# Altium schematic sheet Lights.SchDoc
size A
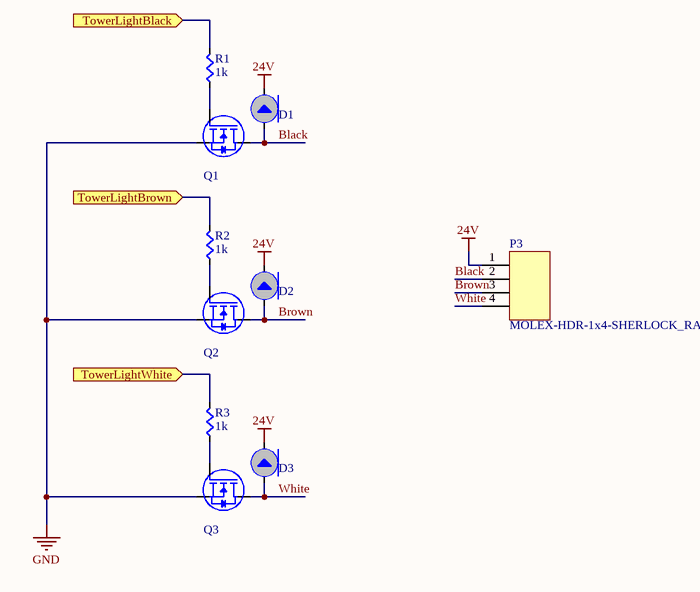
[diagram p0: Lights.SchDoc]

## Parts
D1  S1B-13-F  [SMASeries]  (value not drawn)
D2  S1B-13-F  [SMASeries]  (value not drawn)
D3  S1B-13-F  [SMASeries]  (value not drawn)
P3  MOLEX-HDR-1x4-SHERLOCK_RA  [MOLEX-HDR-1X4-SHERLOCK-RA]
Q1  BSN20-7  [SOT-323]  (value not drawn)
Q2  BSN20-7  [SOT-323]  (value not drawn)
Q3  BSN20-7  [SOT-323]  (value not drawn)
R1  value 1k  [RES0603]  (hidden comment: Res)
R2  value 1k  [RES0603]  (hidden comment: Res)
R3  value 1k  [RES0603]  (hidden comment: Res)

## Ports
TowerLightBlack (in), TowerLightBrown (in), TowerLightWhite (in)

## Nets
24V: D1.C D2.C D3.C P3.1
GND: Q1.2(S) Q2.2(S) Q3.2(S)
Black: D1.A P3.2 Q1.3(D)
Brown: D2.A P3.3 Q2.3(D)
TowerLightBlack: R1.1(A) ; port TowerLightBlack
TowerLightBrown: R2.1(A) ; port TowerLightBrown
TowerLightWhite: R3.1(A) ; port TowerLightWhite
White: D3.A P3.4 Q3.3(D)
NetQ1_1: Q1.1(G) R1.2(B)
NetQ2_1: Q2.1(G) R2.2(B)
NetQ3_1: Q3.1(G) R3.2(B)

## Library data of the parts
D1-D3 = Diode: Standard Diode Template; Supplier 1: Digi-Key; Supplier Part Number 1: S1B-FDICT-ND
P3 = MOLEX-HDR-1x4-SHERLOCK_RA: Header, Molex, 2mm Pitch Sherlock Header, Single Row, Horizontal, 4 Circuits, Length 3.3mm; Manufacturer Part Number: 0353630460; Supplier Part Number 1: WM18933-ND; Manufacturer: Molex; Supplier 1: Digikey
Q1-Q3 = NMOSFET: NMOSFET Template; Supplier 1: Digi-Key; Supplier Part Number 1: BSN20-7DICT-ND
R1-R3 = Res: Supplier 1: Digi-Key; Supplier Part Number 1: RMCF0603JT10K0CT-ND